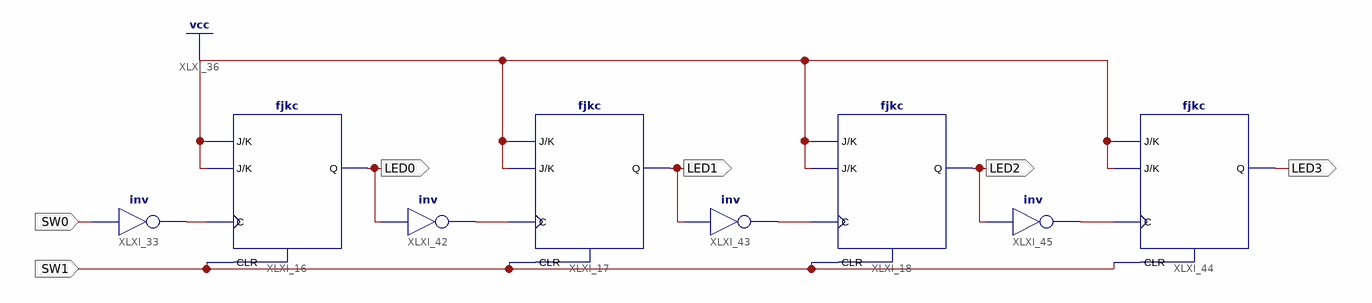
[diagram p0: schematic sheet 1]
// Xilinx ISE schematic BCDto7Segment.sch (spartan6) as structural Verilog: 8 symbols, 6 ports
module BCDto7Segment (
  input  SW0,
  input  SW1,
  output LED0,
  output LED1,
  output LED3,
  output LED2
);

  wire XLXN_42, XLXN_79, XLXN_85, XLXN_89;

  fjkc XLXI_16 (.C(XLXN_42), .CLR(SW1), .J(1'b1), .K(1'b1), .Q(LED0));
  fjkc XLXI_18 (.C(XLXN_85), .CLR(SW1), .J(1'b1), .K(1'b1), .Q(LED2));
  fjkc XLXI_17 (.C(XLXN_79), .CLR(SW1), .J(1'b1), .K(1'b1), .Q(LED1));
  not XLXI_33 (XLXN_42, SW0);
  not XLXI_42 (XLXN_79, LED0);
  not XLXI_43 (XLXN_85, LED1);
  fjkc XLXI_44 (.C(XLXN_89), .CLR(SW1), .J(1'b1), .K(1'b1), .Q(LED3));
  not XLXI_45 (XLXN_89, LED2);

  // Notes on the sheet:
  //   CLOCK_DEDICATED_ROUTE on signal SW0 = TRUE
endmodule
